# EAGLE design NOT GATE (EAGLE 6.5.0)
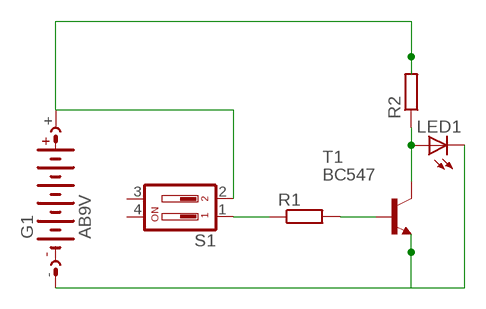
[diagram p0: schematic, sheet 1]

## Parts
G1  AB9V  [AB9V]
LED1  LED5MM  [LED5MM]
R1  R-EU_0204/7  [0204/7]
R2  R-EU_0204/7  [0204/7]
S1  DS02  [DS-02]
T1  BC547  [TO92]

## Nets
N$1: R1.2 T1.2(B)
N$2: LED1.A R2.1 T1.3(C)
N$3: R1.1 S1.1
N$4: G1.+ R2.2 S1.2
N$5: G1.- LED1.K(C) T1.1(E)
Unconnected: S1.3 S1.4

## Library data of the parts
G1 = battery:AB9V: 9-V BATTERY CLIP
LED1 = led:LED: LED OSRAM: - CHIPLED LG R971, LG N971, LY N971, LG Q971, LY Q971, LO R971, LY R971 LH N974, LH R974 LS Q976, LO Q976, LY Q976 LO Q996 - Hyper CHIPLED LW Q18S LB Q993, LB Q99A, LB R99A - SideLED LS A670, LO A670, LY A670, LG A670, LP A670 LB A673, LV A673, LT A673, LW A673 LH A674 LY A675 LS A676, LA A676, LO A676, LY A676, LW A676 LS A679, LY A679, LG A679 - Hyper Micro SIDELED® LS Y876, LA Y876, LO Y876, LY Y876 LT Y87S - SmartLED LW L88C, LW L88S LB L89C, LB L89S, LG L890 LS L89K, LO L89K, LY L89K LS L896, LA L896, LO L896, LY L896 - TOPLED LS T670, LO T670, LY T670, LG T670, LP T670 LSG T670, LSP T670, LSY T670, LOP T670, LYG T670 LG T671, LOG T671, LSG T671 LB T673, LV T673, LT T673, LW T673 LH T674 LS T676, LA T676, LO T676, LY T676, LB T676, LH T676, LSB T676, LW T676 LB T67C, LV T67C, LT T67C, LS T67K, LO T67K, LY T67K, LW E67C LS E67B, LA E67B, LO E67B, LY E67B, LB E67C, LV E67C, LT E67C LW T67C LS T679, LY T679, LG T679 LS T770, LO T770, LY T770, LG T770, LP T770 LB T773, LV T773, LT T773, LW T773 LH T774 LS E675, LA E675, LY E675, LS T675 LS T776, LA T776, LO T776, LY T776, LB T776 LHGB T686 LT T68C, LB T68C - Hyper Mini TOPLED® LB M676 - Mini TOPLED Santana® LG M470 LS M47K, LO M47K, LY M47K Source: http://www.osram.convergy.de LUXEON: - LUMILED® LXK2-PW12-R00, LXK2-PW12-S00, LXK2-PW14-U00, LXK2-PW14-V00 LXK2-PM12-R00, LXK2-PM12-S00, LXK2-PM14-U00 LXK2-PE12-Q00, LXK2-PE12-R00, LXK2-PE12-S00, LXK2-PE14-T00, LXK2-PE14-U00 LXK2-PB12-K00, LXK2-PB12-L00, LXK2-PB12-M00, LXK2-PB14-N00, LXK2-PB14-P00, LXK2-PB14-Q00 LXK2-PR12-L00, LXK2-PR12-M00, LXK2-PR14-Q00, LXK2-PR14-R00 LXK2-PD12-Q00, LXK2-PD12-R00, LXK2-PD12-S00 LXK2-PH12-R00, LXK2-PH12-S00 LXK2-PL12-P00, LXK2-PL12-Q00, LXK2-PL12-R00 Source: www.luxeon.com KINGBRIGHT: KA-3528ASYC Source: www.kingbright.com
R1 R2 = rcl:R-EU_: RESISTOR, European symbol
S1 = switch-dil:DS02: DIL/CODE SWITCH; OC_FARNELL: 9472126; OC_NEWARK: unknown
T1 = transistor:BC547: NPN TRANSISTOR

## Board
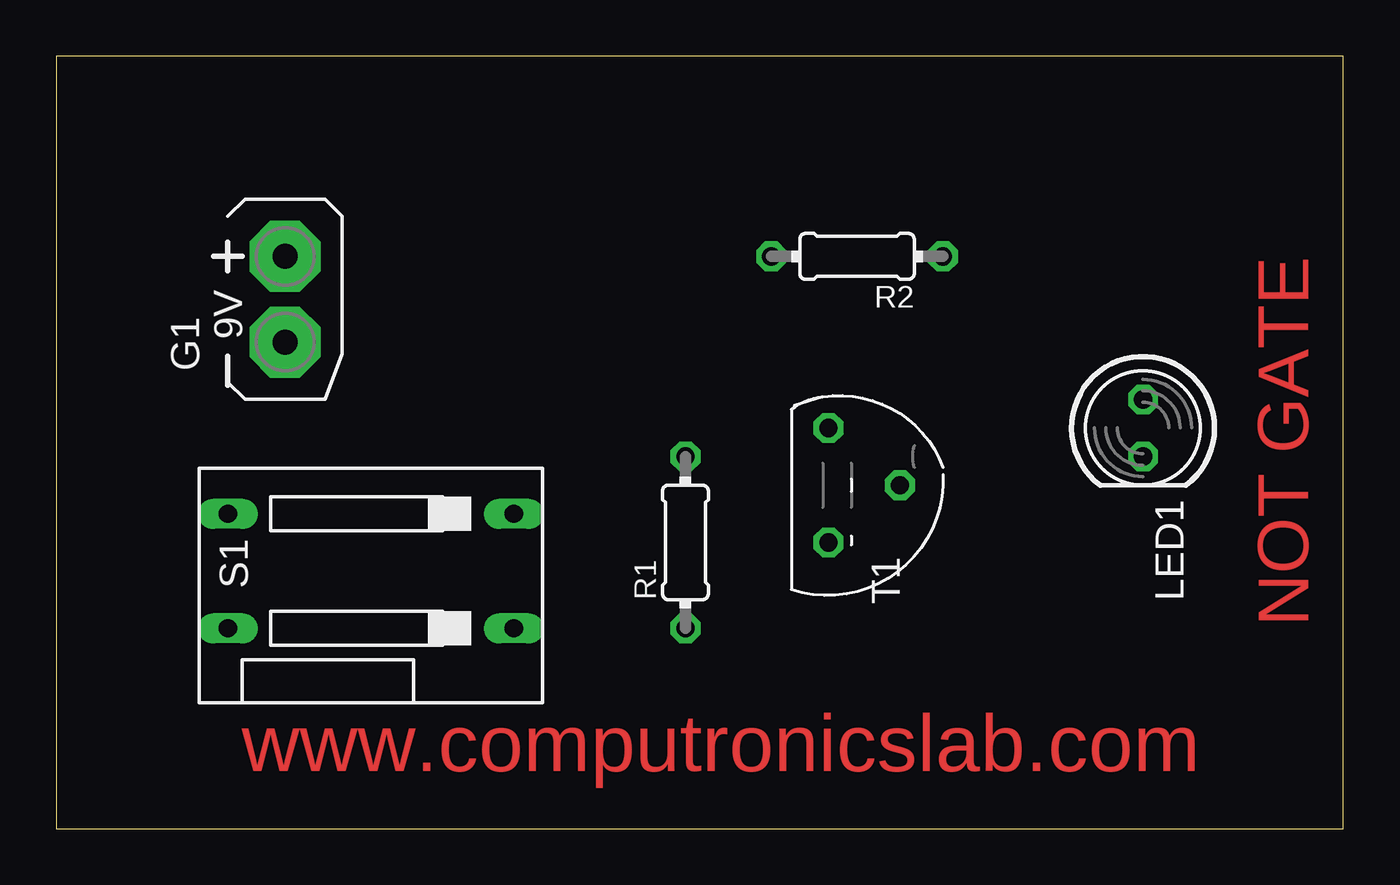
[diagram p1: board, top side]
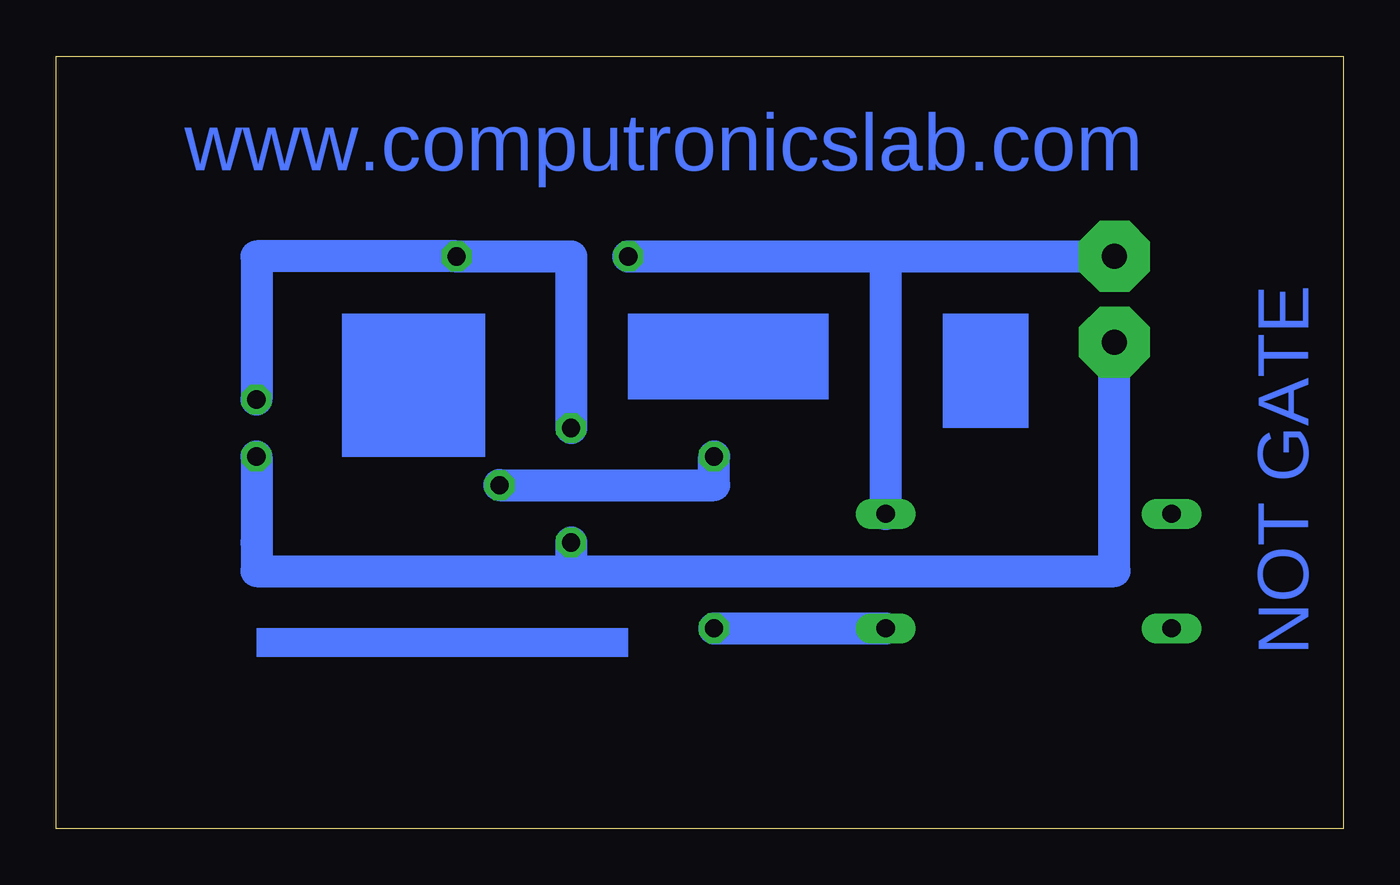
[diagram p2: board, bottom side, seen from below]

Size 57.15 x 34.28 mm. Coordinates in mm from the lower left corner, seen from the top.
Outline: 0,0 57.15,0 57.15,34.28 0,34.28 0,0
Copper layers (1*16): Top 0.035mm / dielectric 1.5mm / Bottom 0.035mm
Design rules "default": minimum track width 10mil, minimum drill 24mil, track to track 8mil, track to pad 8mil, pad to pad 8mil, via to via 8mil, smd to smd 8mil, copper to edge 40mil, drill to drill 8mil, minimum pad ring 10mil, minimum via ring 8mil, stop-mask expansion 4mil, vias tented up to drill 0mil, thermal gap 10mil

### Footprints (pad centres in the part's own frame; a part is rotated, then mirrored left to right if it is on the bottom)
AB9V = drill 1.118 pad 3.15 octagon: + 0,2.54; - 0,-1.27
LED5MM = drill 0.813 octagon: A -1.27,0; K 1.27,0
0204/7 = drill 0.813 octagon: 1 -3.81,0; 2 3.81,0
DS-02 = drill 0.813 long: 1 -5.08,-6.35; 2 0,-6.35; 3 0,6.35; 4 -5.08,6.35
TO92 = drill 0.813 octagon: 1 2.54,-1.27; 2 0,1.905; 3 -2.54,-1.27

### Placement (x,y rotation side)
G1  10.16,22.86 0 top
LED1  48.26,17.78 270 top
R1  27.94,12.7 90 top
R2  35.56,25.4 180 top
S1  13.97,13.97 90 top
T1  35.56,15.24 270 top

### Tracks (layer width: path | path; a pad name or v marks a point on that pad's centre or on a via)
N$1
  Bottom 1.422: R1.2 27.94,15.24 T1.2
N$2
  Bottom 1.422: T1.3 34.29,25.4 R2.1 48.26,25.4 LED1.A
N$3
  Bottom 1.422: R1.1 S1.1
N$4
  Bottom 1.422: R2.2 20.32,25.4 | 20.32,25.4 S1.2 | 20.32,25.4 G1.+
N$5
  Bottom 1.422: 48.26,12.7 LED1.K 48.26,11.43 34.29,11.43 | G1.- 10.16,11.43 34.29,11.43 | T1.1 34.29,11.43
(copper drawn outside any net)
  shapes: Bottom area x4

### Text on the board
Top: NOT GATE | www.computronicslab.com
Bottom: www.computronicslab.com | NOT GATE